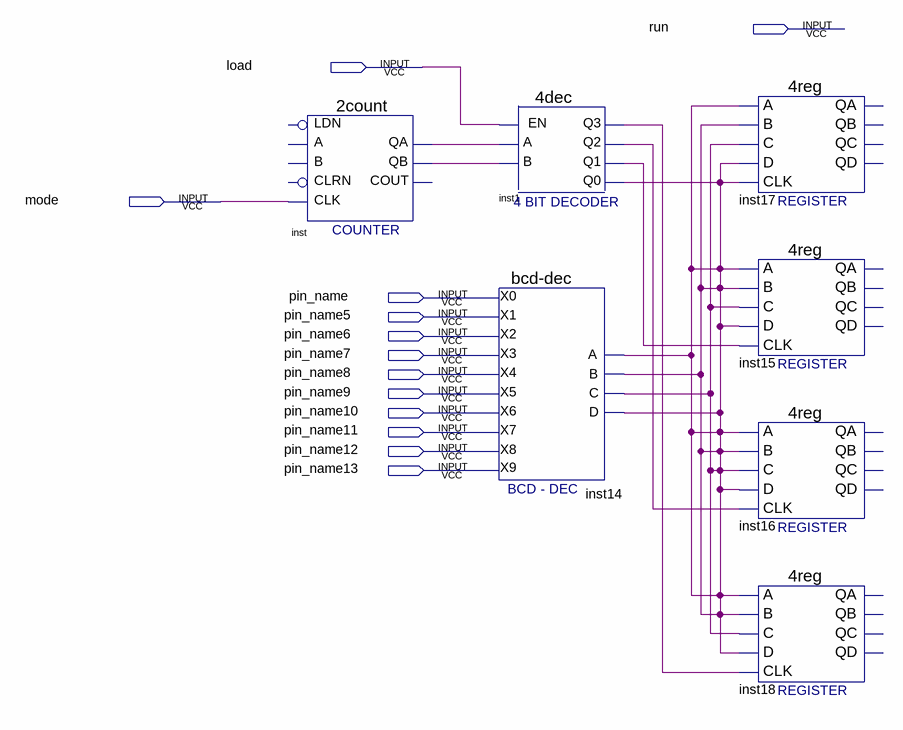
[diagram p0: schematic sheet]
// Quartus schematic q4.bdf as structural Verilog: 7 symbols, 13 pins
module q4 (
  input  run,
  input  load,
  input  mode,
  input  pin_name,
  input  pin_name5,
  input  pin_name6,
  input  pin_name7,
  input  pin_name8,
  input  pin_name9,
  input  pin_name10,
  input  pin_name11,
  input  pin_name12,
  input  pin_name13
);

  wire inst1_q0, inst1_q1, inst1_q2, inst1_q3, inst_qa, inst_qb;

  \2count  inst (.CLK(mode), .QA(inst_qa), .QB(inst_qb));  // open: LDN, B, A, CLRN, COUT
  \4dec  inst1 (.B(inst_qb), .A(inst_qa), .EN(load), .Q2(inst1_q2), .Q3(inst1_q3), .Q0(inst1_q0), .Q1(inst1_q1));
  \bcd-dec  inst14 (
    .X0(pin_name), .X1(pin_name5), .X2(pin_name6), .X3(pin_name7), .X4(pin_name8), .X5(pin_name9),
    .X6(pin_name10), .X7(pin_name11), .X8(pin_name12), .X9(pin_name13), .A(inst1_q0), .B(inst1_q0),
    .C(inst1_q0), .D(inst1_q0));
  \4reg  inst17 (.A(inst1_q0), .C(inst1_q0), .B(inst1_q0), .D(inst1_q0), .CLK(inst1_q0));  // open: QA, QB, QD, QC
  \4reg  inst15 (.A(inst1_q0), .C(inst1_q0), .B(inst1_q0), .D(inst1_q0), .CLK(inst1_q1));  // open: QA, QB, QD, QC
  \4reg  inst16 (.A(inst1_q0), .C(inst1_q0), .B(inst1_q0), .D(inst1_q0), .CLK(inst1_q2));  // open: QA, QB, QD, QC
  \4reg  inst18 (.A(inst1_q0), .C(inst1_q0), .B(inst1_q0), .D(inst1_q0), .CLK(inst1_q3));  // open: QA, QB, QD, QC
endmodule
